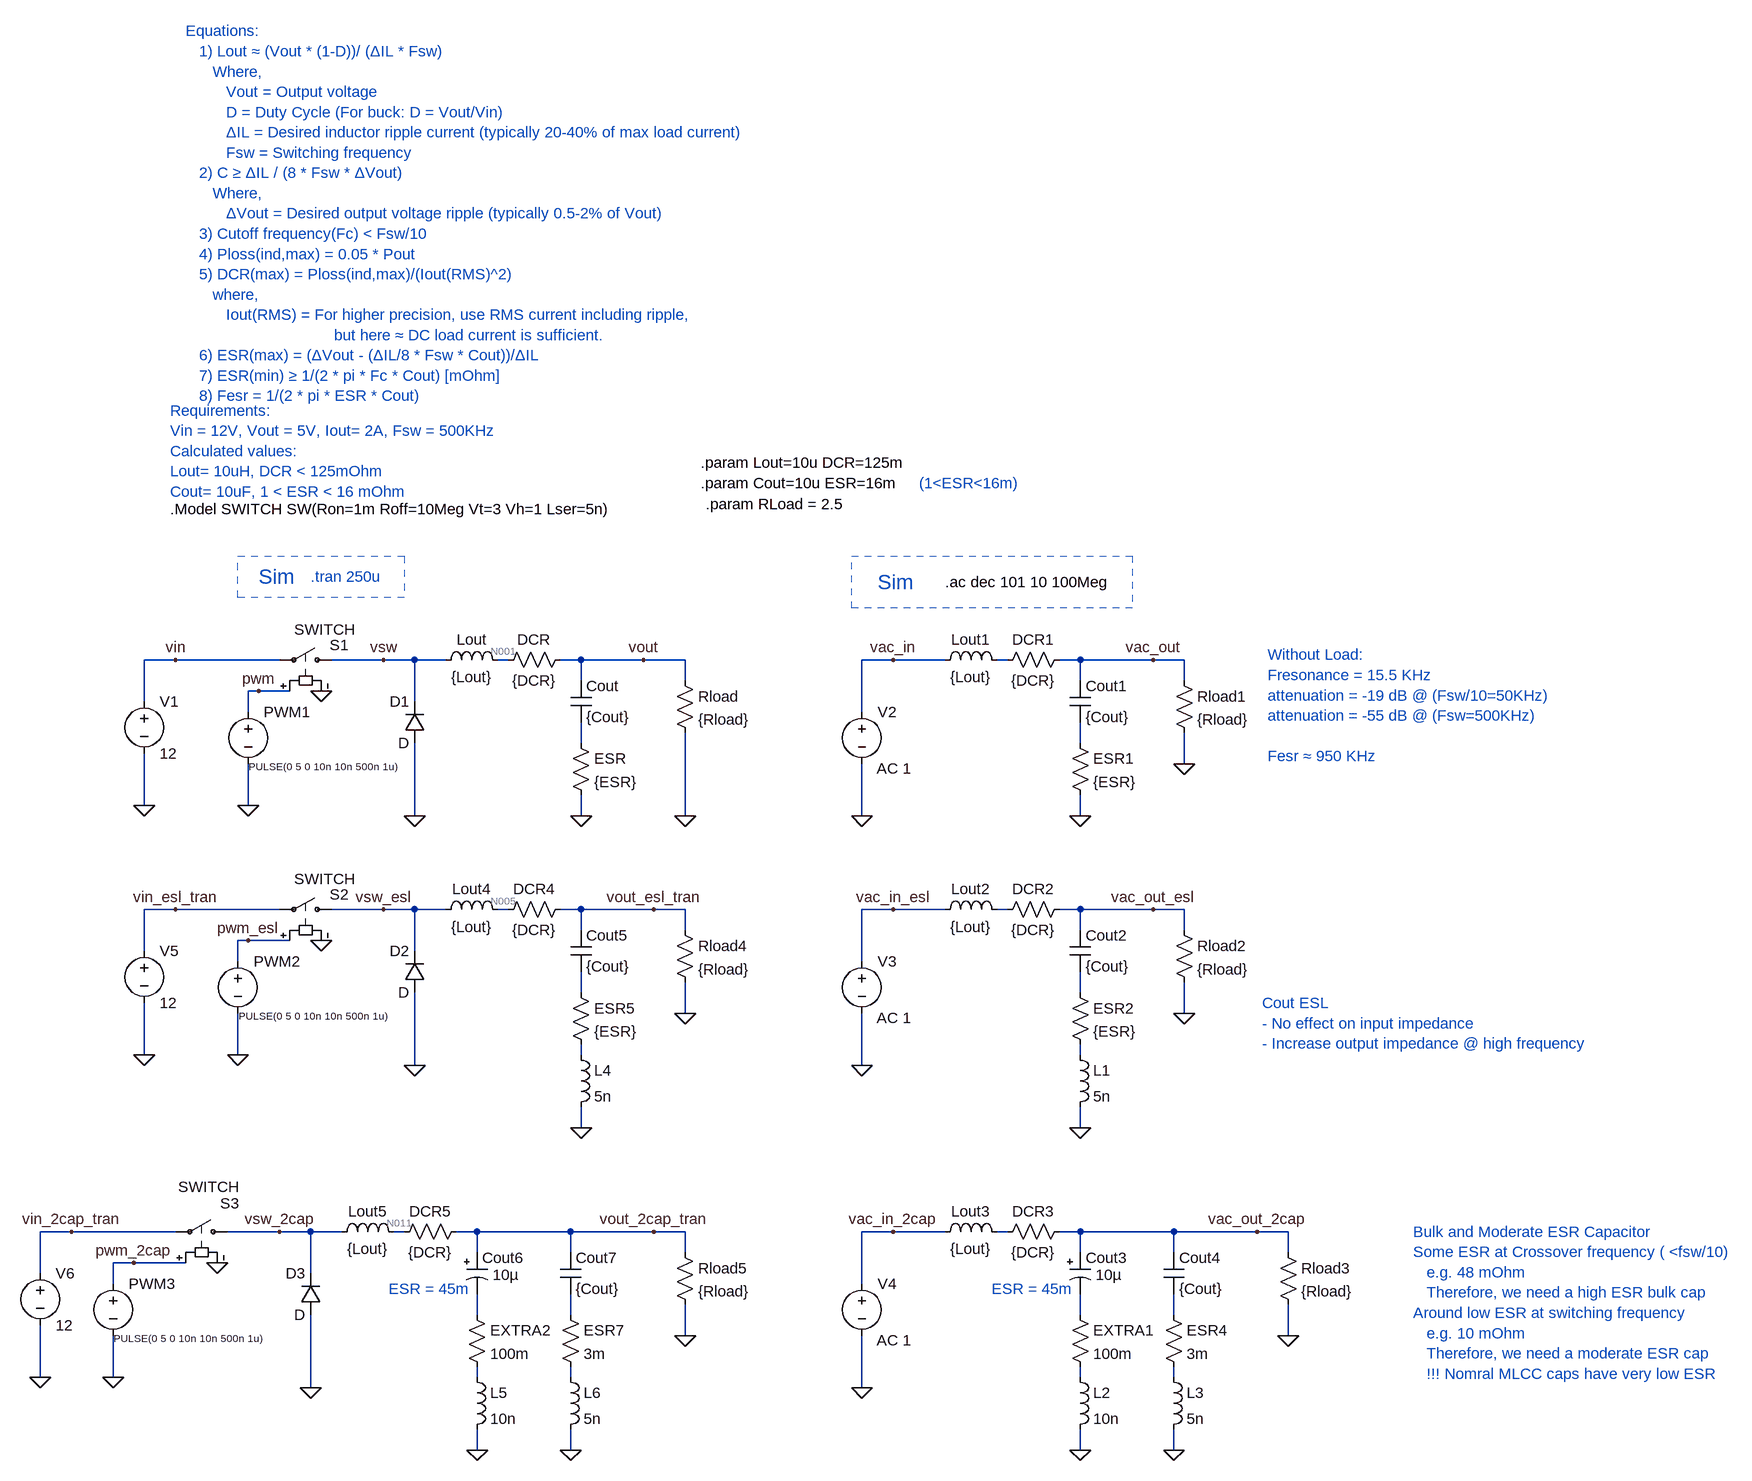
[diagram p0: schematic 02-buck_output_filter_calculation.asc]
02-buck_output_filter_calculation.asc, the LTspice schematic file:
Version 4
SHEET 1 2132 1604
WIRE -320 176 -368 176
WIRE -160 176 -320 176
WIRE 0 176 -80 176
WIRE 48 176 0 176
WIRE 96 176 48 176
WIRE 192 176 176 176
WIRE 304 176 272 176
WIRE 400 176 304 176
WIRE 464 176 400 176
WIRE 784 176 736 176
WIRE 864 176 784 176
WIRE 960 176 944 176
WIRE 1072 176 1040 176
WIRE 1184 176 1072 176
WIRE 1232 176 1184 176
WIRE 304 208 304 176
WIRE 464 208 464 176
WIRE 1072 208 1072 176
WIRE 1232 208 1232 176
WIRE -192 224 -208 224
WIRE -144 224 -192 224
WIRE -368 240 -368 176
WIRE 48 240 48 176
WIRE -208 256 -208 224
WIRE 736 256 736 176
WIRE 304 304 304 272
WIRE 1072 304 1072 272
WIRE 1232 336 1232 288
WIRE -368 400 -368 320
WIRE -208 400 -208 336
WIRE 48 416 48 304
WIRE 304 416 304 384
WIRE 464 416 464 288
WIRE 736 416 736 336
WIRE 1072 416 1072 384
WIRE -320 560 -368 560
WIRE -160 560 -320 560
WIRE 0 560 -80 560
WIRE 48 560 0 560
WIRE 96 560 48 560
WIRE 192 560 176 560
WIRE 304 560 272 560
WIRE 416 560 304 560
WIRE 464 560 416 560
WIRE 784 560 736 560
WIRE 864 560 784 560
WIRE 960 560 944 560
WIRE 1072 560 1040 560
WIRE 1184 560 1072 560
WIRE 1232 560 1184 560
WIRE 304 592 304 560
WIRE 464 592 464 560
WIRE 1072 592 1072 560
WIRE 1232 592 1232 560
WIRE -208 608 -224 608
WIRE -144 608 -208 608
WIRE -368 624 -368 560
WIRE 48 624 48 560
WIRE -224 640 -224 608
WIRE 736 640 736 560
WIRE 304 688 304 656
WIRE 1072 688 1072 656
WIRE 464 720 464 672
WIRE 1232 720 1232 672
WIRE -368 784 -368 704
WIRE -224 784 -224 720
WIRE 304 784 304 768
WIRE 1072 784 1072 768
WIRE 48 800 48 688
WIRE 736 800 736 720
WIRE 304 896 304 864
WIRE 1072 896 1072 864
WIRE -480 1056 -528 1056
WIRE -320 1056 -480 1056
WIRE -160 1056 -240 1056
WIRE -112 1056 -160 1056
WIRE -64 1056 -112 1056
WIRE 32 1056 16 1056
WIRE 144 1056 112 1056
WIRE 288 1056 144 1056
WIRE 416 1056 288 1056
WIRE 464 1056 416 1056
WIRE 784 1056 736 1056
WIRE 864 1056 784 1056
WIRE 960 1056 944 1056
WIRE 1072 1056 1040 1056
WIRE 1216 1056 1072 1056
WIRE 1344 1056 1216 1056
WIRE 1392 1056 1344 1056
WIRE 144 1088 144 1056
WIRE 288 1088 288 1056
WIRE 464 1088 464 1056
WIRE 1072 1088 1072 1056
WIRE 1216 1088 1216 1056
WIRE 1392 1088 1392 1056
WIRE -384 1104 -416 1104
WIRE -304 1104 -384 1104
WIRE -528 1120 -528 1056
WIRE -112 1120 -112 1056
WIRE -416 1136 -416 1104
WIRE 736 1136 736 1056
WIRE 144 1184 144 1152
WIRE 288 1184 288 1152
WIRE 1072 1184 1072 1152
WIRE 1216 1184 1216 1152
WIRE 464 1216 464 1168
WIRE 1392 1216 1392 1168
WIRE -528 1280 -528 1200
WIRE -416 1280 -416 1216
WIRE 144 1280 144 1264
WIRE 288 1280 288 1264
WIRE 1072 1280 1072 1264
WIRE 1216 1280 1216 1264
WIRE -112 1296 -112 1184
WIRE 736 1296 736 1216
WIRE 144 1392 144 1360
WIRE 288 1392 288 1360
WIRE 1072 1392 1072 1360
WIRE 1216 1392 1216 1360
FLAG 304 416 0
FLAG 48 416 0
FLAG -96 224 0
FLAG -208 400 0
FLAG -192 224 pwm
FLAG -368 400 0
FLAG 464 416 0
FLAG -320 176 vin
FLAG 0 176 vsw
FLAG 400 176 vout
FLAG 1072 416 0
FLAG 736 416 0
FLAG 784 176 vac_in
FLAG 1184 176 vac_out
FLAG 1232 336 0
FLAG 1072 896 0
FLAG 736 800 0
FLAG 784 560 vac_in_esl
FLAG 1184 560 vac_out_esl
FLAG 1232 720 0
FLAG 1072 1392 0
FLAG 736 1296 0
FLAG 784 1056 vac_in_2cap
FLAG 1344 1056 vac_out_2cap
FLAG 1392 1216 0
FLAG 1216 1392 0
FLAG 48 800 0
FLAG -96 608 0
FLAG -224 784 0
FLAG -208 608 pwm_esl
FLAG -368 784 0
FLAG -320 560 vin_esl_tran
FLAG 0 560 vsw_esl
FLAG 304 896 0
FLAG 416 560 vout_esl_tran
FLAG 464 720 0
FLAG 144 1392 0
FLAG 416 1056 vout_2cap_tran
FLAG 464 1216 0
FLAG 288 1392 0
FLAG -112 1296 0
FLAG -256 1104 0
FLAG -416 1280 0
FLAG -384 1104 pwm_2cap
FLAG -528 1280 0
FLAG -480 1056 vin_2cap_tran
FLAG -160 1056 vsw_2cap
SYMBOL ind 80 192 R270
WINDOW 0 32 56 VTop 2
WINDOW 3 5 56 VBottom 2
SYMATTR InstName Lout
SYMATTR Value {Lout}
SYMBOL res 288 160 R90
WINDOW 0 0 56 VBottom 2
WINDOW 3 32 56 VTop 2
SYMATTR InstName DCR
SYMATTR Value {DCR}
SYMBOL cap 288 208 R0
SYMATTR InstName Cout
SYMATTR Value {Cout}
SYMBOL res 288 288 R0
SYMATTR InstName ESR
SYMATTR Value {ESR}
SYMBOL diode 64 304 R180
WINDOW 0 24 64 Left 2
WINDOW 3 24 0 Left 2
SYMATTR InstName D1
SYMBOL sw -64 176 M270
WINDOW 0 23 19 VLeft 2
WINDOW 3 47 73 VLeft 2
SYMATTR InstName S1
SYMATTR Value SWITCH
SYMBOL voltage -208 240 R0
WINDOW 3 1 100 Left 1
WINDOW 123 0 0 Left 0
WINDOW 39 0 0 Left 0
SYMATTR Value PULSE(0 5 0 10n 10n 500n 1u)
SYMATTR InstName PWM1
SYMBOL voltage -368 224 R0
WINDOW 123 0 0 Left 0
WINDOW 39 0 0 Left 0
SYMATTR InstName V1
SYMATTR Value 12
SYMBOL res 448 192 R0
SYMATTR InstName Rload
SYMATTR Value {Rload}
SYMBOL ind 848 192 R270
WINDOW 0 32 56 VTop 2
WINDOW 3 5 56 VBottom 2
SYMATTR InstName Lout1
SYMATTR Value {Lout}
SYMBOL res 1056 160 R90
WINDOW 0 0 56 VBottom 2
WINDOW 3 32 56 VTop 2
SYMATTR InstName DCR1
SYMATTR Value {DCR}
SYMBOL cap 1056 208 R0
SYMATTR InstName Cout1
SYMATTR Value {Cout}
SYMBOL res 1056 288 R0
SYMATTR InstName ESR1
SYMATTR Value {ESR}
SYMBOL voltage 736 240 R0
WINDOW 123 23 103 Left 2
WINDOW 39 0 0 Left 0
SYMATTR Value2 AC 1
SYMATTR InstName V2
SYMATTR Value ""
SYMBOL ind 848 576 R270
WINDOW 0 32 56 VTop 2
WINDOW 3 5 56 VBottom 2
SYMATTR InstName Lout2
SYMATTR Value {Lout}
SYMBOL res 1056 544 R90
WINDOW 0 0 56 VBottom 2
WINDOW 3 32 56 VTop 2
SYMATTR InstName DCR2
SYMATTR Value {DCR}
SYMBOL cap 1056 592 R0
SYMATTR InstName Cout2
SYMATTR Value {Cout}
SYMBOL res 1056 672 R0
SYMATTR InstName ESR2
SYMATTR Value {ESR}
SYMBOL voltage 736 624 R0
WINDOW 123 23 103 Left 2
WINDOW 39 0 0 Left 0
SYMATTR Value2 AC 1
SYMATTR InstName V3
SYMATTR Value ""
SYMBOL ind 1056 768 R0
SYMATTR InstName L1
SYMATTR Value 5n
SYMBOL res 1216 192 R0
SYMATTR InstName Rload1
SYMATTR Value {Rload}
SYMBOL res 1216 576 R0
SYMATTR InstName Rload2
SYMATTR Value {Rload}
SYMBOL ind 848 1072 R270
WINDOW 0 32 56 VTop 2
WINDOW 3 5 56 VBottom 2
SYMATTR InstName Lout3
SYMATTR Value {Lout}
SYMBOL res 1056 1040 R90
WINDOW 0 0 56 VBottom 2
WINDOW 3 32 56 VTop 2
SYMATTR InstName DCR3
SYMATTR Value {DCR}
SYMBOL polcap 1056 1088 R0
WINDOW 3 40 34 Left 2
SYMATTR InstName Cout3
SYMATTR Value 10µ
SYMATTR Description Capacitor
SYMATTR Type cap
SYMATTR SpiceLine V=16 Rser=45m
SYMBOL res 1056 1168 R0
SYMATTR InstName EXTRA1
SYMATTR Value 100m
SYMBOL voltage 736 1120 R0
WINDOW 123 23 103 Left 2
WINDOW 39 0 0 Left 0
SYMATTR Value2 AC 1
SYMATTR InstName V4
SYMATTR Value ""
SYMBOL ind 1056 1264 R0
SYMATTR InstName L2
SYMATTR Value 10n
SYMBOL res 1376 1072 R0
SYMATTR InstName Rload3
SYMATTR Value {Rload}
SYMBOL cap 1200 1088 R0
SYMATTR InstName Cout4
SYMATTR Value {Cout}
SYMBOL res 1200 1168 R0
SYMATTR InstName ESR4
SYMATTR Value 3m
SYMBOL ind 1200 1264 R0
SYMATTR InstName L3
SYMATTR Value 5n
SYMBOL diode 64 688 R180
WINDOW 0 24 64 Left 2
WINDOW 3 24 0 Left 2
SYMATTR InstName D2
SYMBOL sw -64 560 M270
WINDOW 0 23 19 VLeft 2
WINDOW 3 47 73 VLeft 2
SYMATTR InstName S2
SYMATTR Value SWITCH
SYMBOL voltage -224 624 R0
WINDOW 3 1 100 Left 1
WINDOW 123 0 0 Left 0
WINDOW 39 0 0 Left 0
SYMATTR Value PULSE(0 5 0 10n 10n 500n 1u)
SYMATTR InstName PWM2
SYMBOL voltage -368 608 R0
WINDOW 123 0 0 Left 0
WINDOW 39 0 0 Left 0
SYMATTR InstName V5
SYMATTR Value 12
SYMBOL ind 80 576 R270
WINDOW 0 32 56 VTop 2
WINDOW 3 5 56 VBottom 2
SYMATTR InstName Lout4
SYMATTR Value {Lout}
SYMBOL res 288 544 R90
WINDOW 0 0 56 VBottom 2
WINDOW 3 32 56 VTop 2
SYMATTR InstName DCR4
SYMATTR Value {DCR}
SYMBOL cap 288 592 R0
SYMATTR InstName Cout5
SYMATTR Value {Cout}
SYMBOL res 288 672 R0
SYMATTR InstName ESR5
SYMATTR Value {ESR}
SYMBOL ind 288 768 R0
SYMATTR InstName L4
SYMATTR Value 5n
SYMBOL res 448 576 R0
SYMATTR InstName Rload4
SYMATTR Value {Rload}
SYMBOL ind -80 1072 R270
WINDOW 0 32 56 VTop 2
WINDOW 3 5 56 VBottom 2
SYMATTR InstName Lout5
SYMATTR Value {Lout}
SYMBOL res 128 1040 R90
WINDOW 0 0 56 VBottom 2
WINDOW 3 32 56 VTop 2
SYMATTR InstName DCR5
SYMATTR Value {DCR}
SYMBOL ind 128 1264 R0
SYMATTR InstName L5
SYMATTR Value 10n
SYMBOL res 448 1072 R0
SYMATTR InstName Rload5
SYMATTR Value {Rload}
SYMBOL cap 272 1088 R0
SYMATTR InstName Cout7
SYMATTR Value {Cout}
SYMBOL res 272 1168 R0
SYMATTR InstName ESR7
SYMATTR Value 3m
SYMBOL ind 272 1264 R0
SYMATTR InstName L6
SYMATTR Value 5n
SYMBOL diode -96 1184 R180
WINDOW 0 24 64 Left 2
WINDOW 3 24 0 Left 2
SYMATTR InstName D3
SYMBOL sw -224 1056 M270
WINDOW 0 44 27 VLeft 2
WINDOW 3 69 92 VLeft 2
SYMATTR InstName S3
SYMATTR Value SWITCH
SYMBOL voltage -416 1120 R0
WINDOW 3 1 100 Left 1
WINDOW 123 0 0 Left 0
WINDOW 39 0 0 Left 0
SYMATTR Value PULSE(0 5 0 10n 10n 500n 1u)
SYMATTR InstName PWM3
SYMBOL voltage -528 1104 R0
WINDOW 123 0 0 Left 0
WINDOW 39 0 0 Left 0
SYMATTR InstName V6
SYMATTR Value 12
SYMBOL polcap 128 1088 R0
WINDOW 3 40 34 Left 2
SYMATTR InstName Cout6
SYMATTR Value 10µ
SYMATTR Description Capacitor
SYMATTR Type cap
SYMATTR SpiceLine V=16 Rser=45m
SYMBOL res 128 1168 R0
SYMATTR InstName EXTRA2
SYMATTR Value 100m
TEXT -328 -208 Left 2 ;Requirements:\nVin = 12V, Vout = 5V, Iout= 2A, Fsw = 500KHz\nCalculated values:\nLout= 10uH, DCR < 125mOhm\nCout= 10uF, 1 < ESR < 16 mOhm
TEXT -328 -56 Left 2 !.Model SWITCH SW(Ron=1m Roff=10Meg Vt=3 Vh=1 Lser=5n)
TEXT -112 48 Left 2 ;.tran 250u
TEXT 864 56 Left 2 !.ac dec 101 10 100Meg
TEXT 1360 168 Left 2 ;Without Load:\nFresonance = 15.5 KHz \nattenuation = -19 dB @ (Fsw/10=50KHz)\nattenuation = -55 dB @ (Fsw=500KHz)\n \nFesr ≈ 950 KHz
TEXT -304 -792 Left 2 ;Equations:\n   1) Lout ≈ (Vout * (1-D))/ (ΔIL * Fsw)\n      Where,\n         Vout = Output voltage\n         D = Duty Cycle (For buck: D = Vout/Vin)\n         ΔIL = Desired inductor ripple current (typically 20-40% of max load current)\n         Fsw = Switching frequency\n   2) C ≥ ΔIL / (8 * Fsw * ΔVout)\n      Where,\n         ΔVout = Desired output voltage ripple (typically 0.5-2% of Vout)\n   3) Cutoff frequency(Fc) < Fsw/10\n   4) Ploss(ind,max) = 0.05 * Pout\n   5) DCR(max) = Ploss(ind,max)/(Iout(RMS)^2)\n      where,\n         Iout(RMS) = For higher precision, use RMS current including ripple, \n                                 but here ≈ DC load current is sufficient.\n   6) ESR(max) = (ΔVout - (ΔIL/8 * Fsw * Cout))/ΔIL\n   7) ESR(min) ≥ 1/(2 * pi * Fc * Cout) [mOhm]\n   8) Fesr = 1/(2 * pi * ESR * Cout)
TEXT 1352 704 Left 2 ;Cout ESL\n- No effect on input impedance\n- Increase output impedance @ high frequency
TEXT 488 -128 Left 2 !.param Lout=10u DCR=125m
TEXT 488 -96 Left 2 !.param Cout=10u ESR=16m
TEXT 496 -64 Left 2 !.param RLoad = 2.5
TEXT 824 -96 Left 2 ;(1<ESR<16m)
TEXT 1584 1056 Left 2 ;Bulk and Moderate ESR Capacitor\nSome ESR at Crossover frequency ( <fsw/10)\n   e.g. 48 mOhm\n   Therefore, we need a high ESR bulk cap\nAround low ESR at switching frequency\n   e.g. 10 mOhm\n   Therefore, we need a moderate ESR cap\n   !!! Nomral MLCC caps have very low ESR
TEXT 760 56 Left 3 ;Sim
TEXT -192 48 Left 3 ;Sim
TEXT 936 1144 Left 2 ;ESR = 45m
TEXT 8 1144 Left 2 ;ESR = 45m
RECTANGLE Normal 32 80 -224 16 2
RECTANGLE Normal 1152 96 720 16 2

The netlist it stands for:
* 02-buck_output_filter_calculation.asc
Lout vsw N001 {Lout}
R§DCR vout N001 {DCR}
Cout vout N003 {Cout}
R§ESR N003 0 {ESR}
D1 0 vsw D
S1 vsw vin pwm 0 SWITCH
V§PWM1 pwm 0 PULSE(0 5 0 10n 10n 500n 1u)
V1 vin 0 12
Rload vout 0 {Rload}
Lout1 vac_in N002 {Lout}
R§DCR1 vac_out N002 {DCR}
Cout1 vac_out N004 {Cout}
R§ESR1 N004 0 {ESR}
V2 vac_in 0 AC 1
Lout2 vac_in_esl N006 {Lout}
R§DCR2 vac_out_esl N006 {DCR}
Cout2 vac_out_esl N008 {Cout}
R§ESR2 N008 N010 {ESR}
V3 vac_in_esl 0 AC 1
L1 N010 0 5n
Rload1 vac_out 0 {Rload}
Rload2 vac_out_esl 0 {Rload}
Lout3 vac_in_2cap N012 {Lout}
R§DCR3 vac_out_2cap N012 {DCR}
Cout3 vac_out_2cap N015 10µ V=16 Rser=45m
R§EXTRA1 N015 N019 100m
V4 vac_in_2cap 0 AC 1
L2 N019 0 10n
Rload3 vac_out_2cap 0 {Rload}
Cout4 vac_out_2cap N016 {Cout}
R§ESR4 N016 N020 3m
L3 N020 0 5n
D2 0 vsw_esl D
S2 vsw_esl vin_esl_tran pwm_esl 0 SWITCH
V§PWM2 pwm_esl 0 PULSE(0 5 0 10n 10n 500n 1u)
V5 vin_esl_tran 0 12
Lout4 vsw_esl N005 {Lout}
R§DCR4 vout_esl_tran N005 {DCR}
Cout5 vout_esl_tran N007 {Cout}
R§ESR5 N007 N009 {ESR}
L4 N009 0 5n
Rload4 vout_esl_tran 0 {Rload}
Lout5 vsw_2cap N011 {Lout}
R§DCR5 vout_2cap_tran N011 {DCR}
L5 N017 0 10n
Rload5 vout_2cap_tran 0 {Rload}
Cout7 vout_2cap_tran N014 {Cout}
R§ESR7 N014 N018 3m
L6 N018 0 5n
D3 0 vsw_2cap D
S3 vsw_2cap vin_2cap_tran pwm_2cap 0 SWITCH
V§PWM3 pwm_2cap 0 PULSE(0 5 0 10n 10n 500n 1u)
V6 vin_2cap_tran 0 12
Cout6 vout_2cap_tran N013 10µ V=16 Rser=45m
R§EXTRA2 N013 N017 100m
.model D D
.lib standard.dio
* Requirements:
* Vin = 12V, Vout = 5V, Iout= 2A, Fsw = 500KHz
* Calculated values:
* Lout= 10uH, DCR < 125mOhm
* Cout= 10uF, 1 < ESR < 16 mOhm
.Model SWITCH SW(Ron=1m Roff=10Meg Vt=3 Vh=1 Lser=5n)
* .tran 250u
.ac dec 101 10 100Meg
* Without Load:
* Fresonance = 15.5 KHz
* attenuation = -19 dB @ (Fsw/10=50KHz)
* attenuation = -55 dB @ (Fsw=500KHz)
* Fesr ≈ 950 KHz
* Equations:
*    1) Lout ≈ (Vout * (1-D))/ (ΔIL * Fsw)
*       Where,
*          Vout = Output voltage
*          D = Duty Cycle (For buck: D = Vout/Vin)
*          ΔIL = Desired inductor ripple current (typically 20-40% of max load current)
*          Fsw = Switching frequency
*    2) C ≥ ΔIL / (8 * Fsw * ΔVout)
*       Where,
*          ΔVout = Desired output voltage ripple (typically 0.5-2% of Vout)
*    3) Cutoff frequency(Fc) < Fsw/10
*    4) Ploss(ind,max) = 0.05 * Pout
*    5) DCR(max) = Ploss(ind,max)/(Iout(RMS)^2)
*       where,
*          Iout(RMS) = For higher precision, use RMS current including ripple,
*                                  but here ≈ DC load current is sufficient.
*    6) ESR(max) = (ΔVout - (ΔIL/8 * Fsw * Cout))/ΔIL
*    7) ESR(min) ≥ 1/(2 * pi * Fc * Cout) [mOhm]
*    8) Fesr = 1/(2 * pi * ESR * Cout)
* Cout ESL
* - No effect on input impedance
* - Increase output impedance @ high frequency
.param Lout=10u DCR=125m
.param Cout=10u ESR=16m
.param RLoad = 2.5
* (1<ESR<16m)
* Bulk and Moderate ESR Capacitor
* Some ESR at Crossover frequency ( <fsw/10)
*    e.g. 48 mOhm
*    Therefore, we need a high ESR bulk cap
* Around low ESR at switching frequency
*    e.g. 10 mOhm
*    Therefore, we need a moderate ESR cap
*    !!! Nomral MLCC caps have very low ESR
* Sim
* Sim
* ESR = 45m
* ESR = 45m
.backanno
.end

* Results of the author's LTspice run, read from the files saved beside the schematic
* Operating Point, zero values left out:
*   V(vsw) = 3.151 µV
*   V(n001) = 3.15 µV
*   V(vout) = 3 µV
*   V(vin) = 12 V
*   V(vsw_esl) = 3.151 µV
*   V(vin_esl_tran) = 12 V
*   V(n005) = 3.15 µV
*   V(vout_esl_tran) = 3 µV
*   V(vsw_2cap) = 3.151 µV
*   V(n011) = 3.15 µV
*   V(vout_2cap_tran) = 3 µV
*   V(vin_2cap_tran) = 12 V
*   I(Lout) = 1.2 µA
*   I(Lout4) = 1.2 µA
*   I(Lout5) = 1.2 µA
*   I(Dcr) = -1.2 µA
*   I(Rload) = 1.2 µA
*   I(Dcr4) = -1.2 µA
*   I(Rload4) = 1.2 µA
*   I(Dcr5) = -1.2 µA
*   I(Rload5) = 1.2 µA
*   I(S1) = 1.2 µA
*   I(S2) = 1.2 µA
*   I(S3) = 1.2 µA
*   I(V1) = -1.2 µA
*   I(V5) = -1.2 µA
*   I(V6) = -1.2 µA
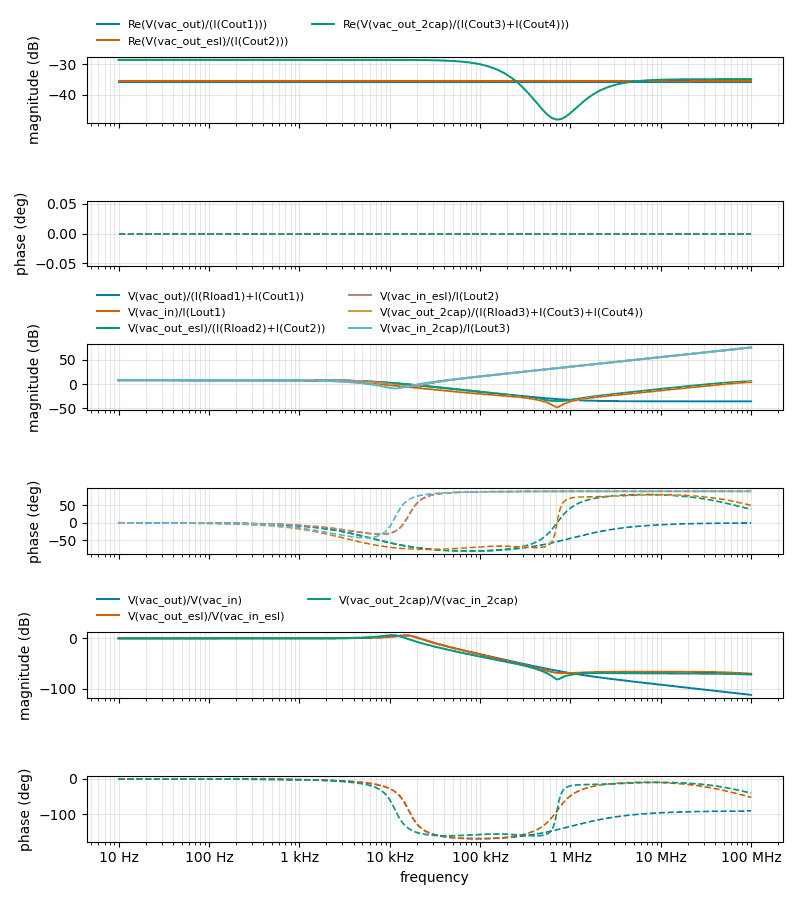
[diagram p1: AC Analysis of 02-buck_output_filter_calculation.asc, plotted from the saved traces]
* AC Analysis, 1 run:
*   Re(V(vac_out)/(I(Cout1))): -35.92 dB at 10 Hz, -35.92 dB at 100 MHz, peak -35.92 dB at 540.3 Hz
*   Re(V(vac_out_esl)/(I(Cout2))): -35.39 dB at 10 Hz, -35.39 dB at 100 MHz, peak -35.39 dB at 77.82 MHz
*   Re(V(vac_out_2cap)/(I(Cout3)+I(Cout4))): -28.52 dB at 10 Hz, -34.90 dB at 100 MHz, peak -28.52 dB at 10 Hz, 3 dB below the peak at 148.3 kHz
*   V(vac_out)/(I(Rload1)+I(Cout1)): 7.96 dB at 10 Hz, -35.97 dB at 100 MHz, peak 7.96 dB at 10 Hz, 3 dB below the peak at 6.326 kHz
*   V(vac_in)/I(Lout1): 8.39 dB at 10 Hz, 75.96 dB at 100 MHz, peak 75.96 dB at 100 MHz, 3 dB below the peak at 70.71 MHz
*   V(vac_out_esl)/(I(Rload2)+I(Cout2)): 7.96 dB at 10 Hz, 5.81 dB at 100 MHz, peak 7.96 dB at 10 Hz, 3 dB below the peak at 6.323 kHz
*   V(vac_in_esl)/I(Lout2): 8.39 dB at 10 Hz, 75.97 dB at 100 MHz, peak 75.97 dB at 100 MHz, 3 dB below the peak at 70.7 MHz
*   V(vac_out_2cap)/(I(Rload3)+I(Cout3)+I(Cout4)): 7.96 dB at 10 Hz, 4.08 dB at 100 MHz, peak 7.96 dB at 10 Hz, 3 dB below the peak at 3.137 kHz
*   V(vac_in_2cap)/I(Lout3): 8.39 dB at 10 Hz, 75.97 dB at 100 MHz, peak 75.97 dB at 100 MHz, 3 dB below the peak at 70.71 MHz
*   V(vac_out)/V(vac_in): -0.43 dB at 10 Hz, -111.94 dB at 100 MHz, peak 5.44 dB at 15.07 kHz, 3 dB below the peak at 9.639 kHz and 19.03 kHz
*   V(vac_out_esl)/V(vac_in_esl): -0.43 dB at 10 Hz, -70.16 dB at 100 MHz, peak 5.42 dB at 15.07 kHz, 3 dB below the peak at 9.62 kHz and 19.02 kHz
*   V(vac_out_2cap)/V(vac_in_2cap): -0.43 dB at 10 Hz, -71.89 dB at 100 MHz, peak 5.88 dB at 10.71 kHz, 3 dB below the peak at 7.161 kHz and 13.37 kHz